# Altium project PCB_Project.PrjPcb
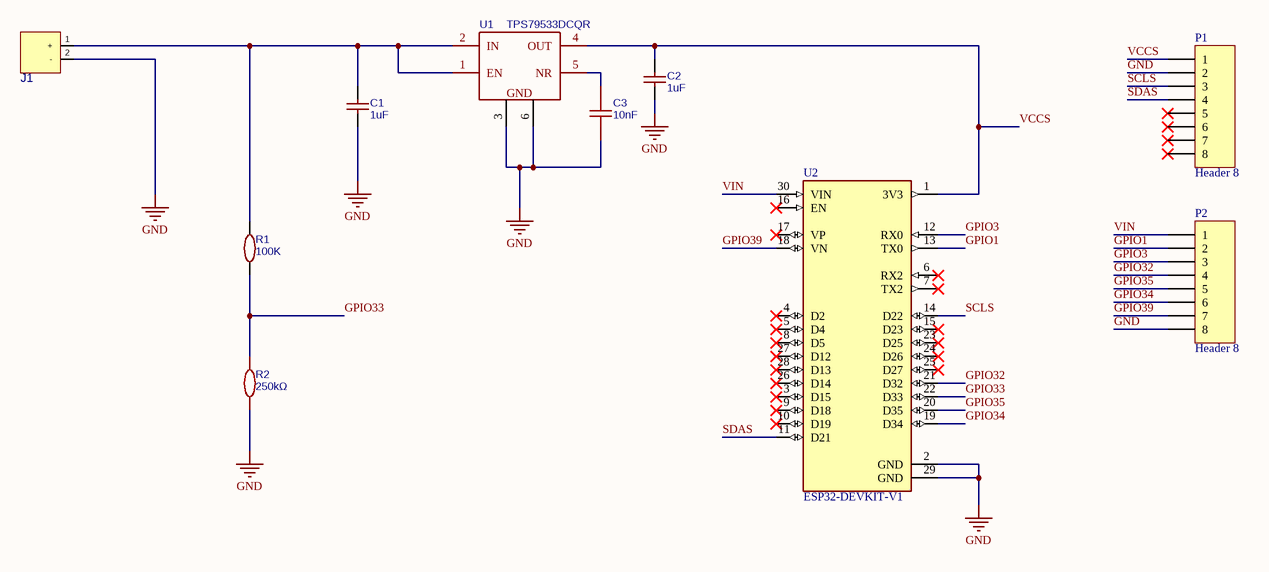
[diagram p0: Sensor_compartment_Schematic.SchDoc]
1 sheet, 10 parts. Net scope: global (net labels, ports and power ports of the same name join across sheets).
Board file: Sensor_compartment.PcbDoc

## Sheet Sensor_compartment_Schematic.SchDoc
size A3

### Parts
C1  1uF  [1uF ceramic cap]
C2  1uF  [1uF ceramic cap]
C3  10nF  [1nF cap]
J1  *  [BATTERY_PAD]  (value not drawn)
P1  Header 8  [HDR1X8]
P2  Header 8  [HDR1X8]
R1  100K  [R100K]
R2  250kΩ  [R250K]
U1  TPS79533DCQR  [TPS79533DCQR]
U2  ESP32-DEVKIT-V1  [MODULE_ESP32_DEVKIT_V1]

### Nets
GND: C1.1 C2.1 C3.1 J1.2(-) P1.2 P2.8 R2.1 U1.3(GND) U1.6(GND) U2.2(GND) U2.29(GND)
GPIO1: P2.2 U2.13(TX0)
GPIO3: P2.3 U2.12(RX0)
GPIO32: P2.4 U2.21(D32)
GPIO33: R1.1 R2.2 U2.22(D33)
GPIO34: P2.6 U2.19(D34)
GPIO35: P2.5 U2.20(D35)
GPIO39: P2.7 U2.18(VN)
SCLS: P1.3 U2.14(D22)
SDAS: P1.4 U2.11(D21)
VCCS: C2.2 P1.1 U1.4(OUT) U2.1(3V3)
VIN: P2.1 U2.30(VIN)
NetC1_2: C1.2 J1.1(+) R1.2 U1.1(EN) U1.2(IN)
NetC3_2: C3.2 U1.5(NR)

Not connected (* = marked no-connect by the designer): P1 5* 6* 7* 8*; U2 3(D15)* 4(D2)* 5(D4)* 6(RX2)* 7(TX2)* 8(D5)* 9(D18)* 10(D19)* 15(D23)* 16(EN)* 17(VP)* 23(D25)* 24(D26)* 25(D27)* 26(D14)* 27(D12)* 28(D13)*

### Library data of the parts
C1 C2 = 1uF: BOM_Manufacturer: Walsin(华新科); BOM_Manufacturer Part: 0805F105Z160CT; nameAlias: Capacitance; Contributor: LCSC; BOM_Supplier: LCSC; BOM_Supplier Part: C123629; BOM_JLCPCB Part Class: Extended Part; spicePre: C; spiceSymbolName: 0805F105Z160
C3 = 10nF: BOM_Manufacturer: Murata Electronics; BOM_Manufacturer Part: GCM216R71H103KA37D; nameAlias: Capacitance; Contributor: LCSC; BOM_Supplier: LCSC; BOM_Supplier Part: C388908; BOM_JLCPCB Part Class: Extended Part; spicePre: C; spiceSymbolName: GCM216R71H103KA37D
J1 = BATTERY_PAD: Battery Connector; Manufacturer: ???; Package: BATTERY_PAD; Part Number: *; Value: *; Voltage: *; Tolerance: *; ComponentLink1Description: Datasheet; Current Rating: *
P1 P2 = Header 8: Header, 8-Pin; LatestRevisionDate: 17-Jul-2002; LatestRevisionNote: Re-released for DXP Platform.; Publisher: Altium Limited
R1 = 100K: BOM_Manufacturer: YAGEO(国巨); BOM_Manufacturer Part: RC0805FR-07100KL; nameAlias: Resistance (Ohms); Resistance: 100kΩ; BOM_Supplier: LCSC; BOM_Supplier Part: C96346; BOM_JLCPCB Part Class: Extended Part; spicePre: R; spiceSymbolName: RC0805FR-07100KL
R2 = 250kΩ: BOM_Manufacturer: Viking(光颉); BOM_Manufacturer Part: AR06BTC2503; Resistance (Ohms): 250K; nameAlias: Resistance; Contributor: LCSC; BOM_Supplier: LCSC; BOM_Supplier Part: C374782; BOM_JLCPCB Part Class: Extended Part; spicePre: R; spiceSymbolName: AR06BTC2503
U1 = TPS79533DCQR: BOM_Manufacturer: TI; BOM_Supplier: LCSC; BOM_Manufacturer Part: TPS79533DCQR; BOM_Supplier Part: C28669; BOM_JLCPCB Part Class: Extended Part; spicePre: U; spiceSymbolName: TPS79533DCQR
U2 = ESP32-DEVKIT-V1: Dual core, Wi-Fi: 2.4 GHz up to 150 Mbits/s,BLE (Bluetooth Low Energy) and legacy Bluetooth, 32 bits, Up to 240 MHz; Value: *; MP: ESP32-DEVKIT-V1; Availability: Unavailable; Package: None; Price: None